# EAGLE design M706D (EAGLE 6.6.0)
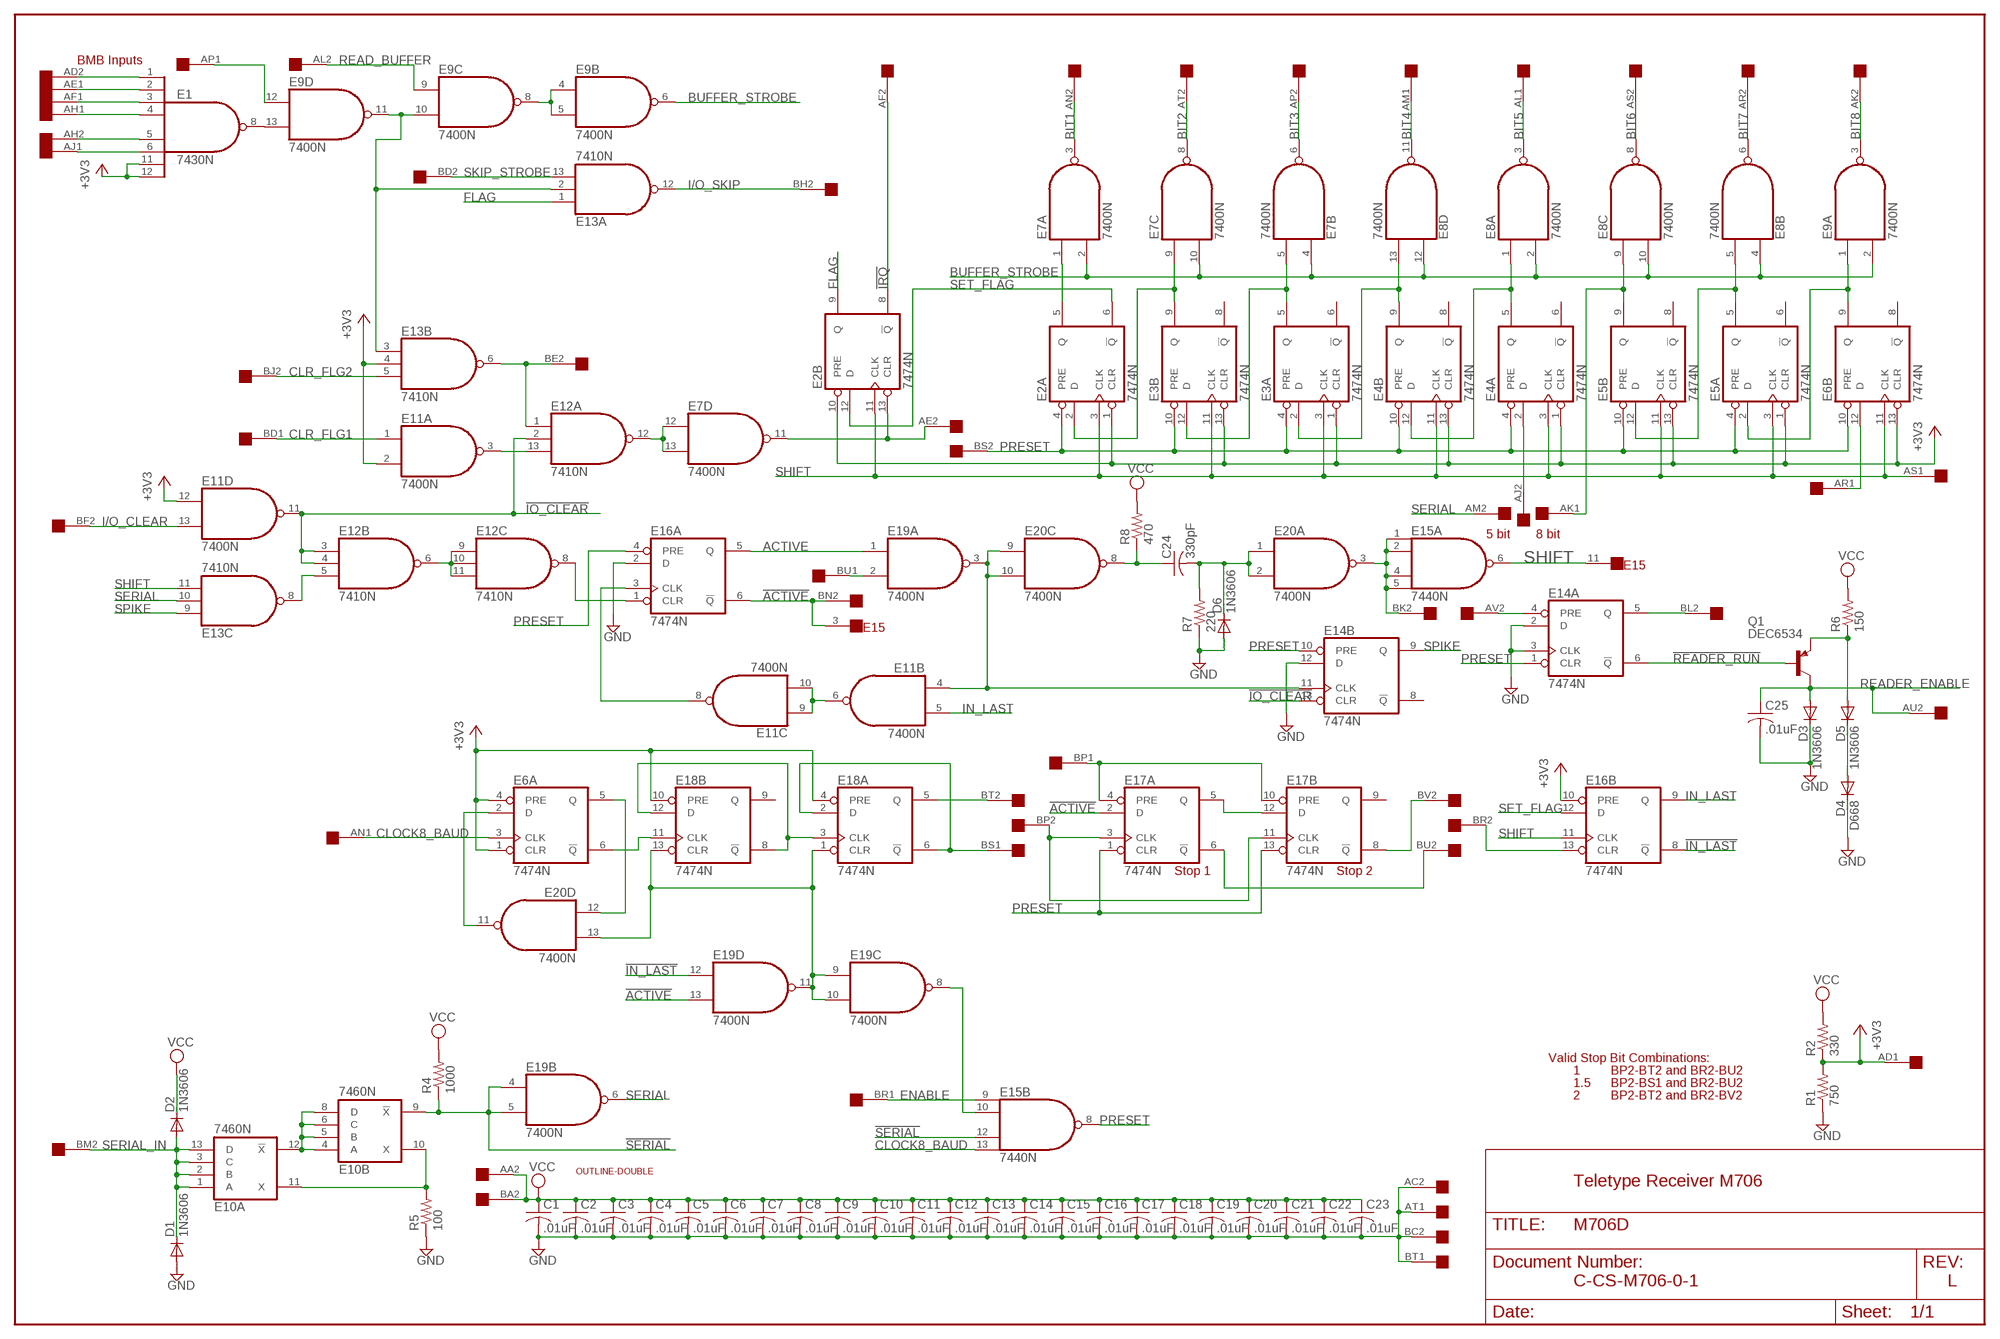
[diagram p0: schematic, sheet 1]

## Parts
C1  .01uF  C-US075-032X103  [C075-032X103]
C2  .01uF  C-US075-032X103  [C075-032X103]
C3  .01uF  C-US075-032X103  [C075-032X103]
C4  .01uF  C-US075-032X103  [C075-032X103]
C5  .01uF  C-US075-032X103  [C075-032X103]
C6  .01uF  C-US075-032X103  [C075-032X103]
C7  .01uF  C-US075-032X103  [C075-032X103]
C8  .01uF  C-US075-032X103  [C075-032X103]
C9  .01uF  C-US075-032X103  [C075-032X103]
C10  .01uF  C-US075-032X103  [C075-032X103]
C11  .01uF  C-US075-032X103  [C075-032X103]
C12  .01uF  C-US075-032X103  [C075-032X103]
C13  .01uF  C-US075-032X103  [C075-032X103]
C14  .01uF  C-US075-032X103  [C075-032X103]
C15  .01uF  C-US075-032X103  [C075-032X103]
C16  .01uF  C-US075-032X103  [C075-032X103]
C17  .01uF  C-US075-032X103  [C075-032X103]
C18  .01uF  C-US075-032X103  [C075-032X103]
C19  .01uF  C-US075-032X103  [C075-032X103]
C20  .01uF  C-US075-032X103  [C075-032X103]
C21  .01uF  C-US075-032X103  [C075-032X103]
C22  .01uF  C-US075-032X103  [C075-032X103]
C23  .01uF  C-US075-032X103  [C075-032X103]
C24  330pF  C-US075-032X103  [C075-032X103]
C25  .01uF  C-US075-032X103  [C075-032X103]
D1  1N3606  DIODE-SOD61B  [SOD61B]
D2  1N3606  DIODE-SOD61B  [SOD61B]
D3  1N3606  1N4148DO35-10  [DO35-10]
D4  D668  1N4148DO35-10  [DO35-10]
D5  1N3606  1N4148DO35-10  [DO35-10]
D6  1N3606  DIODE-SOD61B  [SOD61B]
E1  7430N  [DIL14]
E2  7474N  74S74N  [DIL14]
E3  7474N  74S74N  [DIL14]
E4  7474N  74S74N  [DIL14]
E5  7474N  74S74N  [DIL14]
E6  7474N  74S74N  [DIL14]
E7  7400N  [DIL14]
E8  7400N  [DIL14]
E9  7400N  [DIL14]
E10  7460N  [DIL14]
E11  7400N  [DIL14]
E12  7410N  [DIL14]
E13  7410N  [DIL14]
E14  7474N  74S74N  [DIL14]
E15  7440N  74S40N  [DIL14]
E16  7474N  74S74N  [DIL14]
E17  7474N  74S74N  [DIL14]
E18  7474N  74S74N  [DIL14]
E19  7400N  [DIL14]
E20  7400N  [DIL14]
Q1  DEC6534  BC327-16-PNP-TO92-EBC  [TO92-EBC]
R1  750  R-US_0207/10  [0207/10]
R2  330  R-US_0207/10  [0207/10]
R4  1000  R-US_0207/15  [0207/15]
R5  100  R-US_0207/15  [0207/15]
R6  150  R-US_0207/10  [0207/10]
R7  220  R-US_0207/15  [0207/15]
R8  470  R-US_0207/15  [0207/15]
U$1  OUTLINE-DOUBLE  [DOUBLE]
U$2  DOUBLE  [EDGE-CON4]

## Nets
2^0: E6.5(A:Q) E20.12(D:I0)
!ACTIVE: E15.3(3:NC) E16.6(A:!Q) E17.2(A:D) E19.13(D:I1) U$2.BN2
!IN_LAST: E16.8(B:!Q) E19.12(D:I0)
!IO_CLEAR: E11.11(D:O) E12.2(A:I1) E12.3(B:I0) E12.4(B:I1) E14.13(B:CLR)
!IRQ: E2.8(B:!Q) U$2.AF2
!READER_RUN: E14.6(A:!Q) Q1.B
!SERIAL: E10.9(B:!X) E15.12(B:I2) E19.4(B:I0) E19.5(B:I1) R4.1
+3V3: E1.11(I6) E1.12(I7) E2.1(A:CLR) E2.10(B:PRE) E3.1(A:CLR) E3.13(B:CLR) E4.1(A:CLR) E4.13(B:CLR) E5.1(A:CLR) E5.13(B:CLR) E6.1(A:CLR) E6.4(A:PRE) E6.13(B:CLR) E11.2(A:I1) E11.12(D:I0) E13.4(B:I1) E16.10(B:PRE) E18.4(A:PRE) E18.10(B:PRE) R1.2 R2.1 U$2.AD1
ACTIVE: E16.5(A:Q) E19.1(A:I0)
BIT1: E7.3(A:O) U$2.AN2
BIT2: E7.8(C:O) U$2.AT2
BIT3: E7.6(B:O) U$2.AP2
BIT4: E8.11(D:O) U$2.AM1
BIT5: E8.3(A:O) U$2.AL1
BIT6: E8.8(C:O) U$2.AS2
BIT7: E8.6(B:O) U$2.AR2
BIT8: E9.3(A:O) U$2.AK2
BUFFER_STROBE: E7.2(A:I1) E7.4(B:I0) E7.10(C:I1) E8.2(A:I1) E8.4(B:I0) E8.10(C:I1) E8.12(D:I0) E9.2(A:I1) E9.6(B:O)
CLOCK8_BAUD: E6.3(A:CLK) E15.13(B:I3) U$2.AN1
CLR_FLG1: E11.1(A:I0) U$2.BD1
CLR_FLG2: E13.5(B:I2) U$2.BJ2
ENABLE: E15.9(B:I0) U$2.BR1
FLAG: E2.9(B:Q) E13.1(A:I0)
GND [Supply]: C1.2 C2.2 C3.2 C4.2 C5.2 C6.2 C7.2 C8.2 C9.2 C10.2 C11.2 C12.2 C13.2 C14.2 C15.2 C16.2 C17.2 C18.2 C19.2 C20.2 C21.2 C22.2 C23.2 C25.2 D1.A D3.C D4.C D6.A E14.2(A:D) E14.3(A:CLK) E14.12(B:D) E16.2(A:D) R1.1 R5.1 R7.1 U$2.AC2 U$2.AT1 U$2.BC2 U$2.BT1
I/O_CLEAR: E11.13(D:I1) U$2.BF2
I/O_SKIP: E13.12(A:O) U$2.BH2
IN_LAST: E11.5(B:I1) E16.9(B:Q)
N$1: E15.10(B:I1) E19.8(C:O)
N$2: E5.5(A:Q) E5.12(B:D) E8.5(B:I1)
N$3: E5.2(A:D) E6.9(B:Q) E9.1(A:I0)
N$4: E5.9(B:Q) E8.9(C:I0) U$2.AK1
N$5: E3.5(A:Q) E3.12(B:D) E7.5(B:I1)
N$6: E3.2(A:D) E4.9(B:Q) E8.13(D:I1)
N$7: E4.5(A:Q) E4.12(B:D) E8.1(A:I0)
N$8: E2.5(A:Q) E7.1(A:I0)
N$9: E2.2(A:D) E3.9(B:Q) E7.9(C:I0)
N$10: E1.8(O) E9.13(D:I1)
N$11: E2.13(B:CLR) E7.11(D:O) U$2.AE2
N$12: E7.12(D:I0) E7.13(D:I1) E12.12(A:O)
N$13: E11.8(C:O) E16.3(A:CLK)
N$14: E6.12(B:D) U$2.AR1
N$15: E1.6(I5) U$2.AJ1
N$16: E9.12(D:I0) U$2.AP1
N$17: E1.1(I0) U$2.AD2
N$18: E1.2(I1) U$2.AE1
N$19: E1.3(I2) U$2.AF1
N$20: E1.4(I3) U$2.AH1
N$21: E1.5(I4) U$2.AH2
N$22: E9.4(B:I0) E9.5(B:I1) E9.8(C:O)
N$23: E9.10(C:I1) E9.11(D:O) E13.2(A:I1) E13.3(B:I0)
N$24: E11.3(A:O) E12.13(A:I2)
N$25: E12.1(A:I0) E13.6(B:O) U$2.BE2
N$26: E15.1(A:I0) E15.2(A:I1) E15.4(A:I2) E15.5(A:I3) E20.3(A:O) U$2.BK2
N$27: E6.2(A:D) E20.11(D:O)
N$28: E12.5(B:I2) E13.8(C:O)
N$29: E12.6(B:O) E12.9(C:I0) E12.10(C:I1) E12.11(C:I2)
N$31: E4.2(A:D) U$2.AJ2
N$32: E12.8(C:O) E16.1(A:CLR)
N$33: E6.6(A:!Q) E18.11(B:CLK)
N$34: E18.3(A:CLK) E18.8(B:!Q) E18.12(B:D)
N$35: E18.5(A:Q) U$2.BT2
N$36: E18.2(A:D) E18.6(A:!Q) U$2.BS1
N$37: E17.3(A:CLK) E17.11(B:CLK) U$2.BP2
N$38: E10.4(B:A) E10.5(B:B) E10.6(B:C) E10.8(B:D) E10.12(A:!X)
N$39: E10.10(B:X) E10.11(A:X) R5.2
N$42: E11.6(B:O) E11.9(C:I0) E11.10(C:I1)
N$43: E11.4(B:I0) E14.11(B:CLK) E19.3(A:O) E20.9(C:I0) E20.10(C:I1)
N$45: E18.1(A:CLR) E18.13(B:CLR) E19.9(C:I0) E19.10(C:I1) E19.11(D:O) E20.13(D:I1)
N$48: C24.1 E20.8(C:O) R8.1
N$50: E14.4(A:PRE) U$2.AV2
N$52: E14.5(A:Q) U$2.BL2
N$53: C24.2 D6.C E20.1(A:I0) E20.2(A:I1) R7.2
N$54: D5.A Q1.E R6.1
N$55: D4.A D5.C
N$57: E16.13(B:CLR) U$2.BR2
N$59: E17.6(A:!Q) U$2.BU2
N$60: E17.8(B:!Q) U$2.BV2
N$61: E17.5(A:Q) E17.12(B:D)
N$62: E17.4(A:PRE) E17.10(B:PRE) U$2.BP1
N$63: E19.2(A:I1) U$2.BU1
PRESET: E2.4(A:PRE) E3.4(A:PRE) E3.10(B:PRE) E4.4(A:PRE) E4.10(B:PRE) E5.4(A:PRE) E5.10(B:PRE) E6.10(B:PRE) E14.1(A:CLR) E14.10(B:PRE) E15.8(B:O) E16.4(A:PRE) E17.1(A:CLR) E17.13(B:CLR) U$2.BS2
READ_BUFFER: E9.9(C:I0) U$2.AL2
READER_ENABLE: C25.1 D3.A Q1.C U$2.AU2
SERIAL: E13.10(C:I1) E19.6(B:O) U$2.AM2
SERIAL_IN: D1.C D2.A E10.1(A:A) E10.2(A:B) E10.3(A:C) E10.13(A:D) U$2.BM2
SET_FLAG: E2.6(A:!Q) E2.12(B:D) E16.12(B:D)
SHIFT: E2.3(A:CLK) E2.11(B:CLK) E3.3(A:CLK) E3.11(B:CLK) E4.3(A:CLK) E4.11(B:CLK) E5.3(A:CLK) E5.11(B:CLK) E6.11(B:CLK) E13.11(C:I2) E15.6(A:O) E15.11(11:NC) E16.11(B:CLK) U$2.AS1
SKIP_STROBE: E13.13(A:I2) U$2.BD2
SPIKE: E13.9(C:I0) E14.9(B:Q)
VCC [Supply]: C1.1 C2.1 C3.1 C4.1 C5.1 C6.1 C7.1 C8.1 C9.1 C10.1 C11.1 C12.1 C13.1 C14.1 C15.1 C16.1 C17.1 C18.1 C19.1 C20.1 C21.1 C22.1 C23.1 D2.C R2.2 R4.2 R6.2 R8.2 U$2.AA2 U$2.BA2
Unconnected: E3.6(A:!Q) E3.8(B:!Q) E4.6(A:!Q) E4.8(B:!Q) E5.6(A:!Q) E5.8(B:!Q) E6.8(B:!Q) E14.8(B:!Q) E17.9(B:Q) E18.9(B:Q) E20.4(B:I0) E20.5(B:I1) E20.6(B:O) U$2.AA1 U$2.AB1 U$2.AB2 U$2.AC1 U$2.AU1 U$2.AV1 U$2.BA1 U$2.BB1 U$2.BB2 U$2.BC1 U$2.BE1 U$2.BF1 U$2.BH1 U$2.BJ1 U$2.BK1 U$2.BL1 U$2.BM1 U$2.BN1 U$2.BV1

## Notes on the sheet
- BMB Inputs
- 5 bit | 8 bit
- Stop 1 | Stop 2
- Valid Stop Bit Combinations:
- 1 | BP2-BT2 and BR2-BU2
- 1.5 | BP2-BS1 and BR2-BU2
- 2 | BP2-BT2 and BR2-BV2
- Teletype Receiver M706
- C-CS-M706-0-1 | L

## Power pins joined to a net without a drawn wire
GND: E1.7(GND) E2.7(P:GND) E3.7(P:GND) E4.7(P:GND) E5.7(P:GND) E6.7(P:GND) E7.7(P:GND) E8.7(P:GND) E9.7(P:GND) E10.7(P:GND) E11.7(P:GND) E12.7(P:GND) E13.7(P:GND) E14.7(P:GND) E15.7(P:GND) E16.7(P:GND) E17.7(P:GND) E18.7(P:GND) E19.7(P:GND) E20.7(P:GND)
VCC: E1.14(VCC) E2.14(P:VCC) E3.14(P:VCC) E4.14(P:VCC) E5.14(P:VCC) E6.14(P:VCC) E7.14(P:VCC) E8.14(P:VCC) E9.14(P:VCC) E10.14(P:VCC) E11.14(P:VCC) E12.14(P:VCC) E13.14(P:VCC) E14.14(P:VCC) E15.14(P:VCC) E16.14(P:VCC) E17.14(P:VCC) E18.14(P:VCC) E19.14(P:VCC) E20.14(P:VCC)

## Library data of the parts
C1-C25 = rcl:C-US: CAPACITOR, American symbol
D1 D2 D6 = diode:DIODE-: DIODE
D3-D5 = diode:1N4148: DIODE high speed (Philips)
E1 = 74xx-us:74*30: 8-input NAND gate
E2-E6 E14 E16-E18 = 74xx-us:74*74: Dual D type positive edge triggered FLIP FLOP, preset and clear
E7-E9 E11 E19 E20 = 74xx-us:74*00: Quad 2-input NAND gate
E10 = 74xx-us:74*60: Dual 4-input EXPANDER
E12 E13 = 74xx-us:74*10: Triple 3-input NAND gate
E15 = dec-con:74*40: Dual 4-input NAND gate
Q1 = transistor:*-PNP-: PNP Transistror
R1 R2 R4-R8 = rcl:R-US_: RESISTOR, American symbol
U$1 = dec-con:OUTLINE-*: Board outlines for DEC boards.
U$2 = dec-con:DOUBLE: Double-Height DEC board

## Net classes
1 Supply: width 0.813 mm

## Board
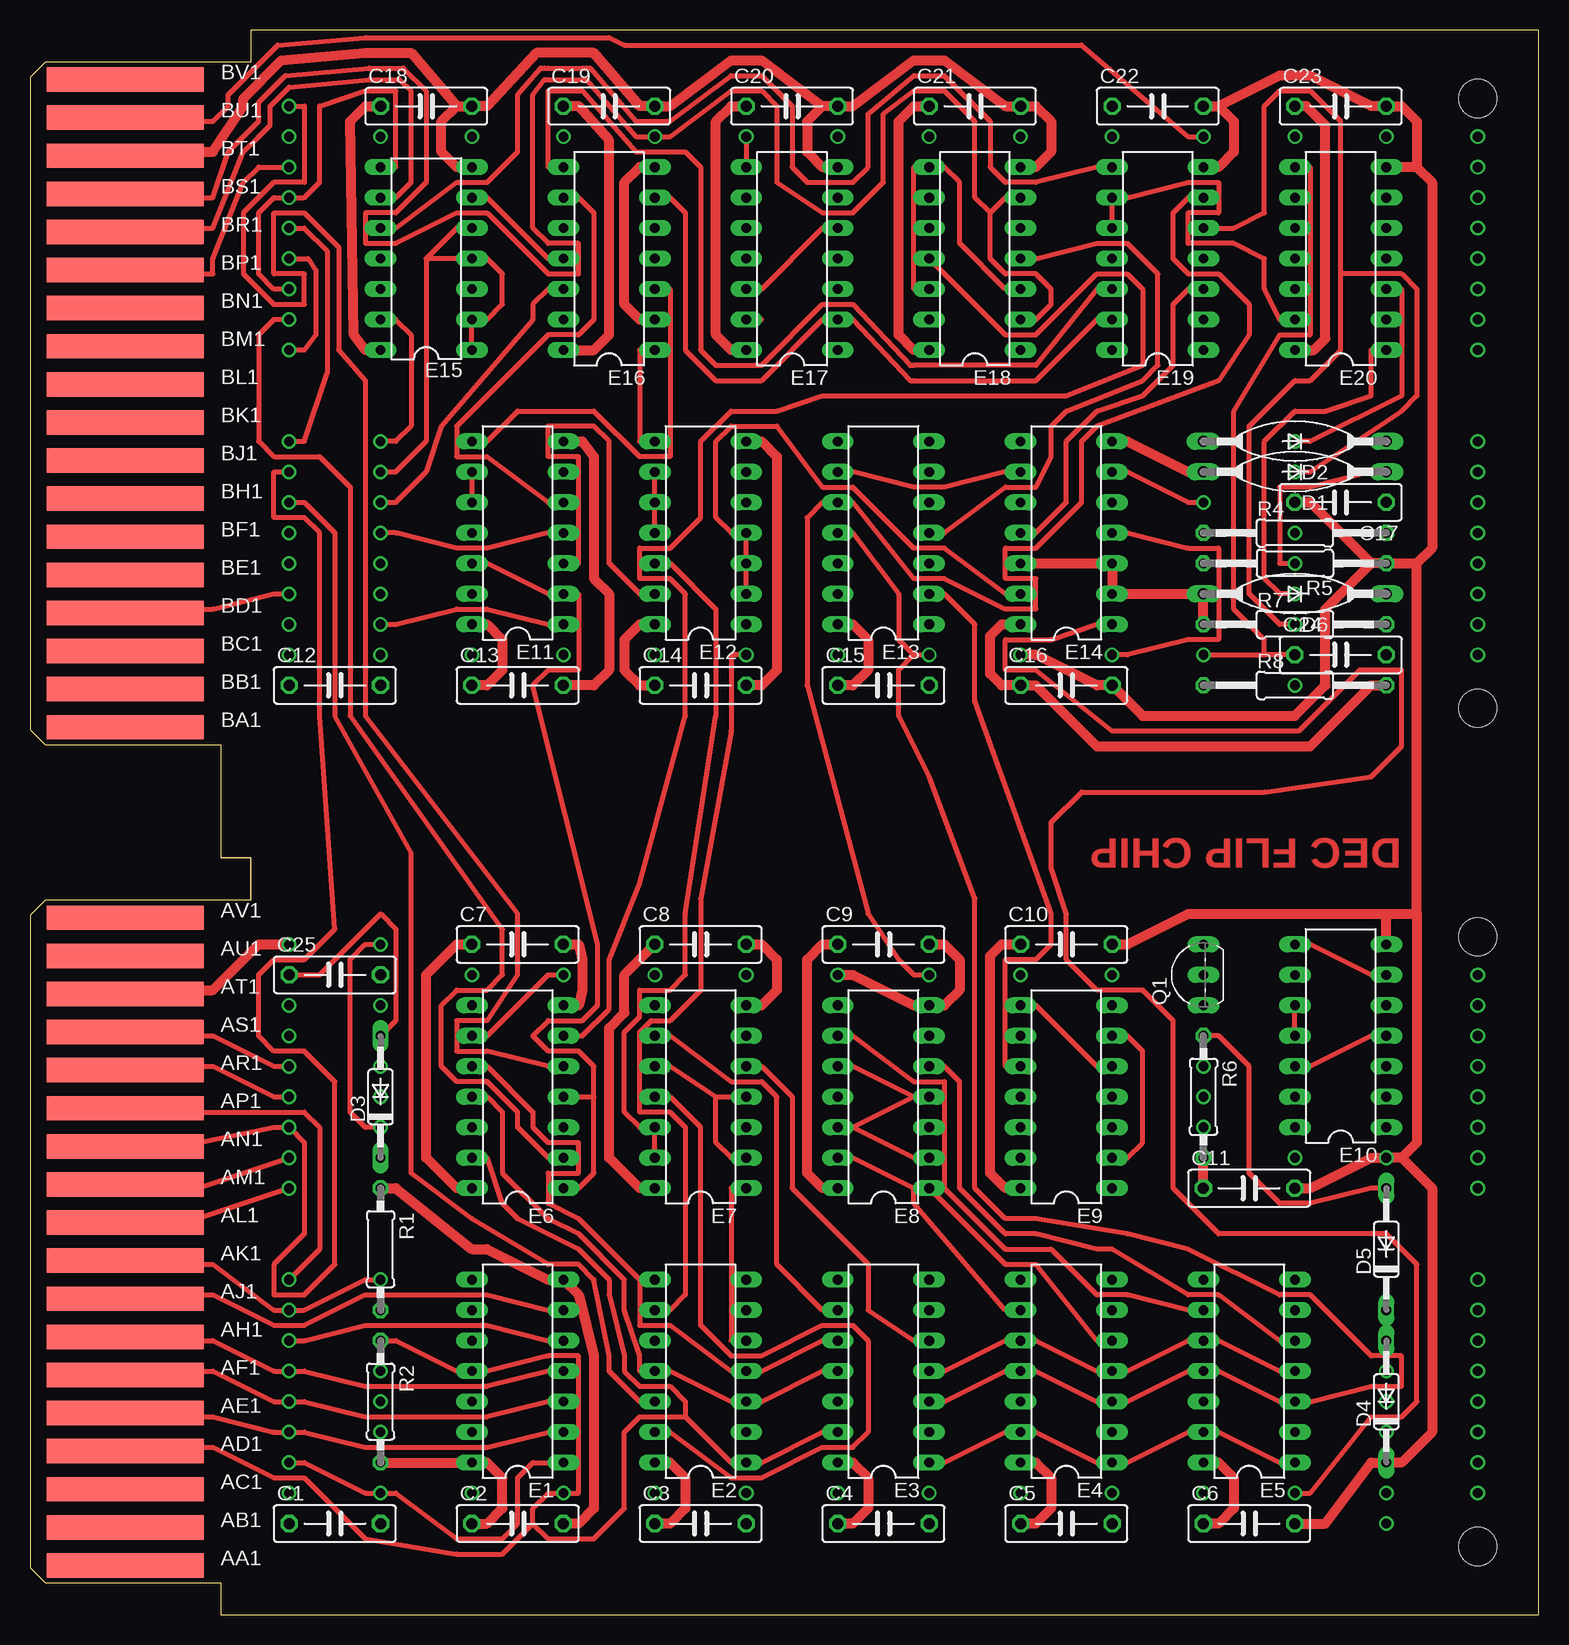
[diagram p1: board, top side]
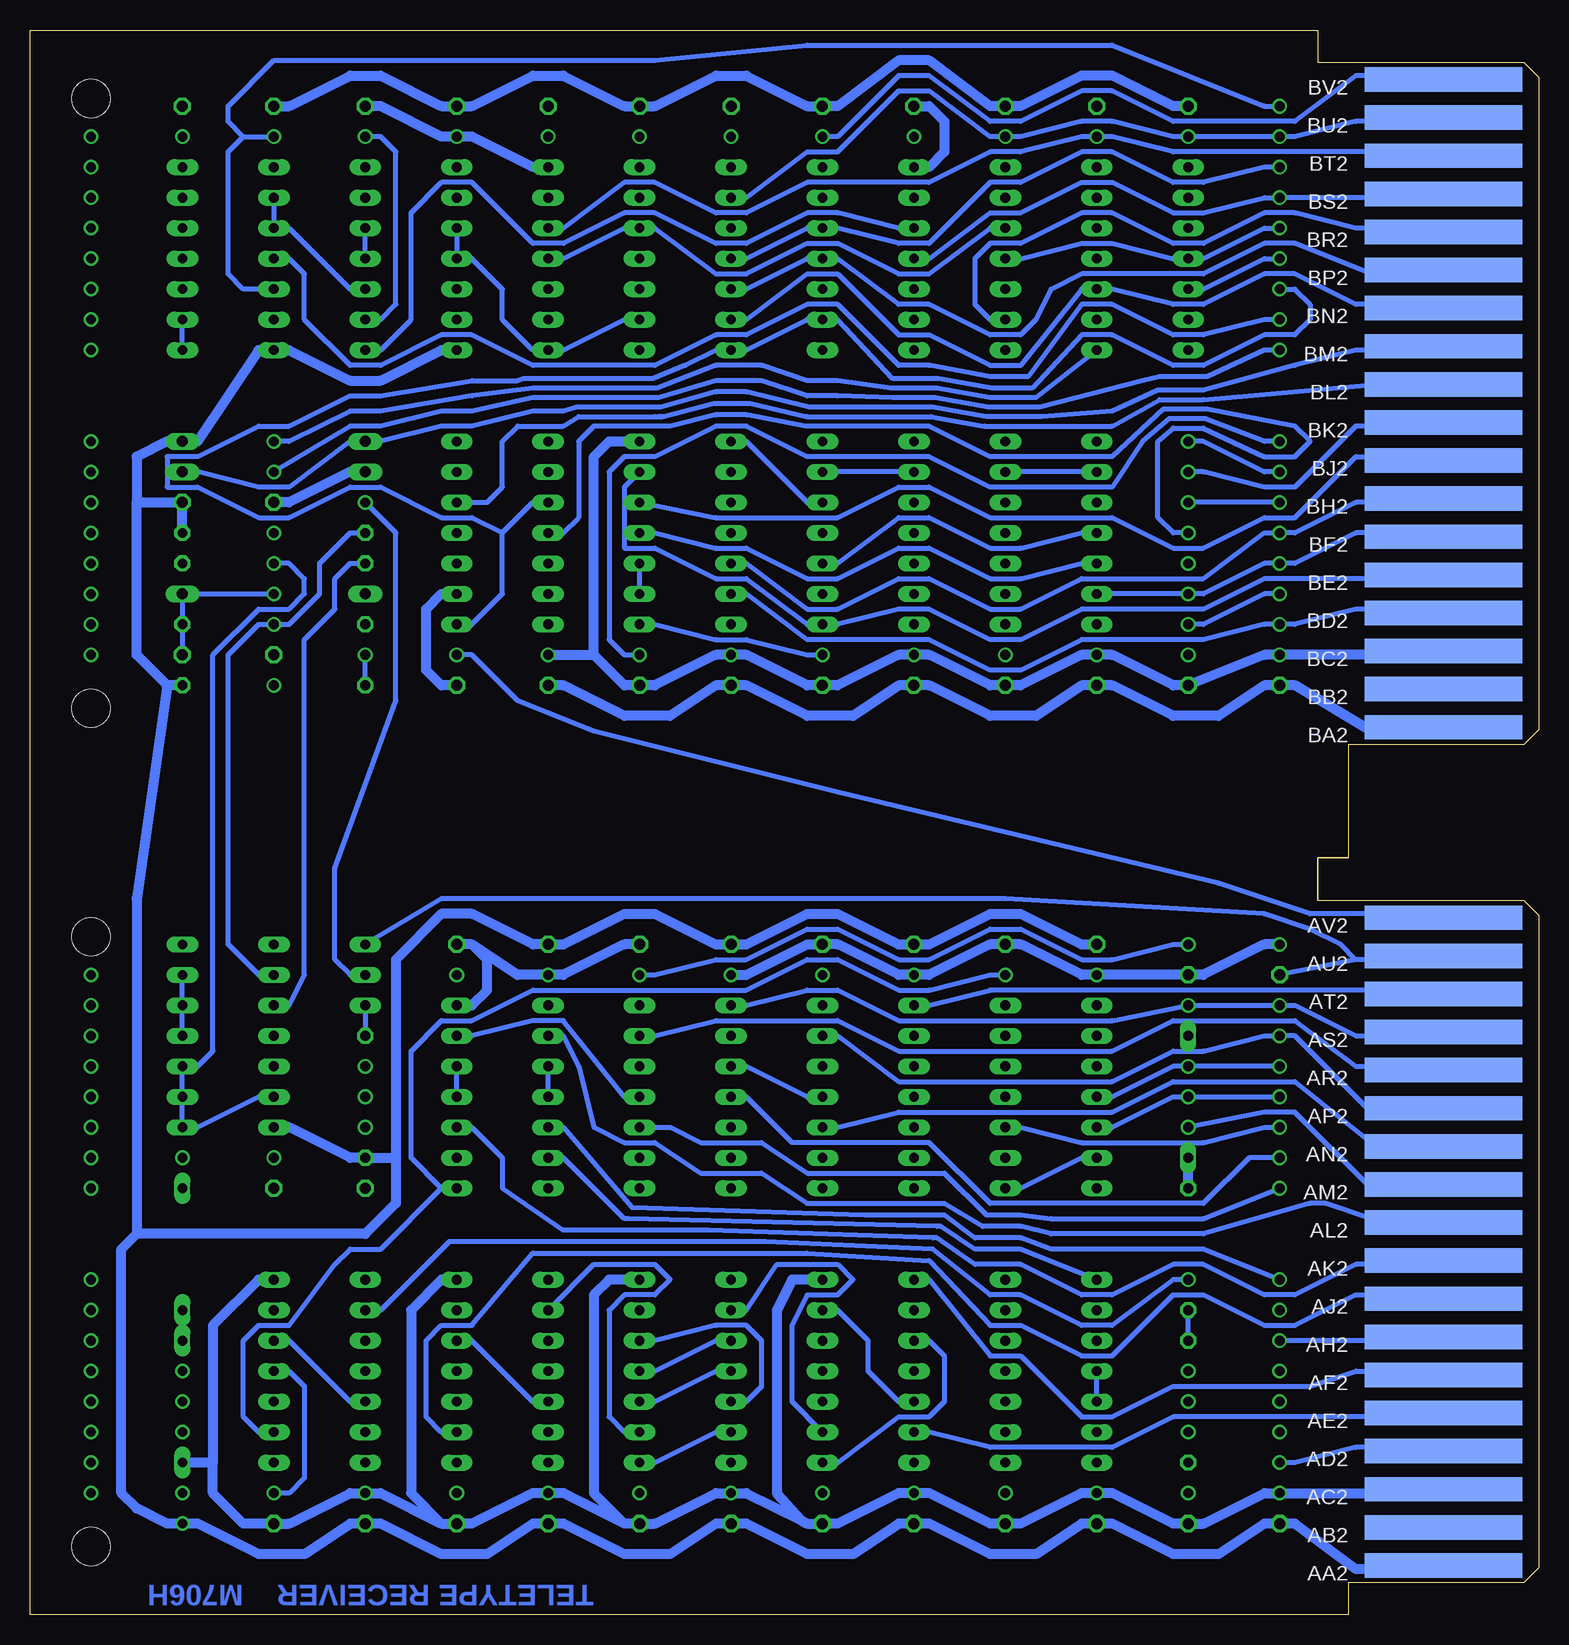
[diagram p2: board, bottom side, seen from below]

Size 125.73 x 132.08 mm. Coordinates in mm from the lower left corner, seen from the top.
Copper layers (1+16): Top 0.035mm / dielectric 1.5mm / Bottom 0.035mm
Design rules "16mils": minimum track width 16mil, minimum drill 32mil, track to track 15mil, track to pad 10mil, pad to pad 10mil, via to via 10mil, smd to smd 10mil, copper to edge 13mil, drill to drill 10mil, minimum pad ring 10mil, minimum via ring 8mil, stop-mask expansion 0mil, vias tented up to drill 0mil, thermal gap 10mil

### Footprints (pad centres in the part's own frame; a part is rotated, then mirrored left to right if it is on the bottom)
C075-032X103 = drill 0.914 octagon: 1 -3.81,0; 2 3.81,0
SOD61B = drill 0.914 long: A 7.62,0; C -7.62,0
DO35-10 = drill 0.813 long: A 5.08,0; C -5.08,0
DIL14 = drill 0.813 long: 1 -7.62,-3.81; 2 -5.08,-3.81; 3 -2.54,-3.81; 4 0,-3.81; 5 2.54,-3.81; 6 5.08,-3.81; 7 7.62,-3.81; 8 7.62,3.81; 9 5.08,3.81; 10 2.54,3.81; 11 0,3.81; 12 -2.54,3.81; 13 -5.08,3.81; 14 -7.62,3.81
TO92-EBC = drill 0.813 long: B 0,-1.27; C 2.54,-1.27; E -2.54,-1.27
0207/10 = drill 0.813 octagon: 1 -5.08,0; 2 5.08,0
0207/15 = drill 0.813 octagon: 1 -7.62,0; 2 7.62,0
DOUBLE = hole 3.175: 120.65,56.515; 120.65,5.715; 120.65,75.565; 120.65,126.365
EDGE-CON4 = smd 13.106 x 2.032: AA1 7.938,4.128; AB1 7.938,7.303; AC1 7.938,10.477; AD1 7.938,13.652; AE1 7.938,16.828; AF1 7.938,20.003; AH1 7.938,23.177; AJ1 7.938,26.352; AK1 7.938,29.527; AL1 7.938,32.703; AM1 7.938,35.877; AN1 7.938,39.053; AP1 7.938,42.227; AR1 7.938,45.403; AS1 7.938,48.578; AT1 7.938,51.752; AU1 7.938,54.928; AV1 7.938,58.102; BA1 7.938,73.978; BB1 7.938,77.153; BC1 7.938,80.328; BD1 7.938,83.502; BE1 7.938,86.677; BF1 7.938,89.853; BH1 7.938,93.028; BJ1 7.938,96.203; BK1 7.938,99.377; BL1 7.938,102.552; BM1 7.938,105.728; BN1 7.938,108.903; BP1 7.938,112.078; BR1 7.938,115.252; BS1 7.938,118.427; BT1 7.938,121.603; BU1 7.938,124.778; BV1 7.938,127.953 | smd 13.106 x 2.032 bottom: AA2 7.938,4.128; AB2 7.938,7.303; AC2 7.938,10.477; AD2 7.938,13.652; AE2 7.938,16.828; AF2 7.938,20.003; AH2 7.938,23.177; AJ2 7.938,26.352; AK2 7.938,29.527; AL2 7.938,32.703; AM2 7.938,35.877; AN2 7.938,39.053; AP2 7.938,42.227; AR2 7.938,45.403; AS2 7.938,48.578; AT2 7.938,51.752; AU2 7.938,54.928; AV2 7.938,58.102; BA2 7.938,73.978; BB2 7.938,77.153; BC2 7.938,80.328; BD2 7.938,83.502; BE2 7.938,86.677; BF2 7.938,89.853; BH2 7.938,93.028; BJ2 7.938,96.203; BK2 7.938,99.377; BL2 7.938,102.552; BM2 7.938,105.728; BN2 7.938,108.903; BP2 7.938,112.078; BR2 7.938,115.252; BS2 7.938,118.427; BT2 7.938,121.603; BU2 7.938,124.778; BV2 7.938,127.953

### Placement (x,y rotation side)
C1  25.4,7.62 0 top
C2  40.64,7.62 0 top
C3  55.88,7.62 0 top
C4  71.12,7.62 0 top
C5  86.36,7.62 0 top
C6  101.6,7.62 0 top
C7  40.64,55.88 0 top
C8  55.88,55.88 0 top
C9  71.12,55.88 0 top
C10  86.36,55.88 0 top
C11  101.6,35.56 0 top
C12  25.4,77.47 0 top
C13  40.64,77.47 0 top
C14  55.88,77.47 0 top
C15  71.12,77.47 0 top
C16  86.36,77.47 0 top
C17  109.22,92.71 180 top
C18  33.02,125.73 0 top
C19  48.26,125.73 0 top
C20  63.5,125.73 0 top
C21  78.74,125.73 0 top
C22  93.98,125.73 0 top
C23  109.22,125.73 0 top
C24  109.22,80.01 0 top
C25  25.4,53.34 0 top
D1  105.41,95.25 180 top
D2  105.41,97.79 180 top
D3  29.21,43.18 90 top
D4  113.03,17.78 90 top
D5  113.03,30.48 90 top
D6  105.41,85.09 180 top
E1  40.64,20.32 90 top
E2  55.88,20.32 90 top
E3  71.12,20.32 90 top
E4  86.36,20.32 90 top
E5  101.6,20.32 90 top
E6  40.64,43.18 90 top
E7  55.88,43.18 90 top
E8  71.12,43.18 90 top
E9  86.36,43.18 90 top
E10  109.22,48.26 90 top
E11  40.64,90.17 90 top
E12  55.88,90.17 90 top
E13  71.12,90.17 90 top
E14  86.36,90.17 90 top
E15  33.02,113.03 90 top
E16  48.26,113.03 90 top
E17  63.5,113.03 90 top
E18  78.74,113.03 90 top
E19  93.98,113.03 90 top
E20  109.22,113.03 90 top
Q1  96.52,53.34 90 top
R1  29.21,30.48 270 top
R2  29.21,17.78 270 top
R4  105.41,90.17 0 top
R5  105.41,87.63 180 top
R6  97.79,43.18 270 top
R7  105.41,82.55 0 top
R8  105.41,77.47 0 top
U$1  0,0 0 top
U$2  0,0 0 top

### Tracks (layer width: path | path; a pad name or v marks a point on that pad's centre or on a via)
2^0  (via drill 0.81)
  Top 0.406: v21.59,125.73 22.86,125.73 22.86,119.38 20.32,119.38 17.78,116.84 17.78,111.76 20.32,109.22 22.86,109.22 22.86,111.76 20.32,111.76 20.32,116.84 22.86,116.84 25.72,113.98 25.72,105.41 27.94,102.87 27.94,74.93 40.64,58.42 40.64,53.34 38.1,49.53 35.56,49.53 35.56,46.99 38.1,46.99 43.18,45.72 E6.5
  Bottom 0.406: E20.12 107.95,110.49 109.22,111.76 109.22,121.92 107.95,123.19 | 107.95,123.19 v105.41,123.19 | 107.95,123.19 109.22,124.46 109.22,125.73 105.41,129.54 73.66,129.54 60.96,130.81 35.56,130.81 22.86,125.73 v21.59,125.73
!ACTIVE
  Top 0.406: E16.6 53.34,118.11 54.61,116.84 54.61,105.41 57.15,102.87 60.96,102.87 66.04,107.95 E17.2 68.58,107.95 73.34,102.87 73.66,102.87 83.82,102.87 88.9,107.95 E19.13
  Bottom 0.406: U$2.BN2 8.89,109.22 15.24,109.22 20.32,111.76 22.86,111.76 27.94,109.22 30.48,109.22 35.56,110.49 E15.3 38.1,110.49 43.18,104.14 45.72,104.14 50.8,106.68 53.34,106.68 58.42,111.76 60.96,111.76 66.04,107.95 E17.2
!IN_LAST
  Top 0.406: E16.8 43.18,120.65 43.18,127 46.04,127 50.48,121.92 54.61,121.92 55.88,120.65 55.88,105.41 57.15,104.14 60.96,104.14 66.04,109.22 68.58,109.22 73.34,104.14 73.66,104.14 83.82,104.14 88.9,110.49 E19.12
!IO_CLEAR
  Top 0.406: E12.2 E12.3 E12.4 58.42,90.17 57.15,91.44 57.15,97.79 58.42,99.06 62.23,99.06 66.04,93.98 68.58,93.98 73.66,88.9 76.2,88.9 81.28,85.09 E14.13
  Bottom 0.406: E12.3 58.42,87.63 53.34,91.44 50.8,91.44 45.72,88.9 43.18,88.9 38.1,90.17 E11.11
!IRQ
  Bottom 0.406: E2.8 50.8,27.94 45.72,21.59 43.18,21.59 38.1,16.51 35.56,16.51 30.48,19.05 19.05,19.05 15.24,20.32 8.89,20.32 U$2.AF2
!READER_RUN  (via drill 0.81)
  Top 0.406: E14.6 91.44,95.25 96.52,92.71 v97.79,92.71
  Bottom 0.406: Q1.B 99.06,53.34 100.33,54.61 100.33,62.23 95.25,76.2 95.25,90.17 v97.79,92.71
!SERIAL  (via drill 0.81)
  Top 0.406: v105.41,82.55 104.14,82.55 101.6,85.09 101.6,99.06 105.41,102.87 106.68,102.87 109.22,105.41 109.22,111.76 | E19.5 100.33,115.57 102.87,116.84 102.87,125.73 104.14,127 106.68,127 109.22,124.46 109.22,111.76 | v21.59,113.03 23.18,113.03 23.81,112.08 23.81,106.68 22.86,105.41 v21.59,105.41 | v105.41,95.25 106.68,95.25 114.3,100.33 115.57,101.6 115.57,110.49 114.3,111.76 109.22,111.76
  Bottom 0.406: E10.9 106.68,53.34 109.22,55.88 109.22,80.01 106.68,82.55 v105.41,82.55 104.14,82.55 101.6,85.09 101.6,87.63 99.06,90.17 R4.1 | E19.4 E19.5 | E15.12 27.94,110.49 22.86,113.03 v21.59,113.03 | v21.59,105.41 22.86,105.41 27.62,103.19 31.59,103.19 33.02,102.87 41.59,100.65 45.88,100.65 50.32,101.44 53.82,101.44 58.42,101.6 60.96,101.6 64.77,102.87 68.58,102.87 73.34,101.44 83.82,101.44 88.9,100.33 91.44,100.33 96.52,99.06 99.06,99.06 v105.41,95.25
+3V3  (via drill 0.81)
  Top 0.406: R2.1 30.48,22.86 35.56,20.32 E1.11 38.1,20.32 43.18,21.59 45.72,21.59 45.72,10.16 v44.45,10.16 43.18,10.16 41.91,8.89 41.91,7.62 | E3.13 66.04,15.24 60.96,12.7 E2.1 58.42,12.7 54.61,16.51 | E3.1 76.2,12.7 81.28,15.24 E4.13 83.82,15.24 88.9,12.7 E4.1 91.44,12.7 96.52,15.24 E5.13 99.06,15.24 104.14,12.7 E5.1 | U$2.AD1 8.89,13.97 15.24,13.97 20.32,11.43 22.86,11.43 27.94,6.35 35.56,5.08 39.37,5.08 41.91,7.62 | 41.91,7.62 43.18,6.35 46.99,6.35 49.53,8.89 49.53,15.24 50.8,16.51 54.61,16.51 | E6.1 45.72,35.56 46.99,36.83 46.99,43.18 | E6.4 46.99,43.18 | 46.99,43.18 46.99,45.72 45.72,46.99 43.18,46.99 41.91,48.26 43.18,49.53 46.04,49.53 47.31,50.8 47.31,55.88 41.91,77.47 43.18,78.74 45.72,78.74 45.72,85.09 E11.2 43.18,85.09 38.1,87.63 E11.12 | 54.61,16.51 54.61,17.78 53.34,19.05 50.8,19.05 49.53,20.32 49.53,21.59 48.26,26.67 48.26,27.94 45.72,30.48 40.64,33.02 39.37,34.29 38.1,38.1 E6.13 | E13.4 76.2,90.17 81.28,93.98 83.82,93.98 85.09,96.52 85.09,99.06 86.36,100.33 92.71,102.87 93.98,104.14 93.98,111.76 91.44,114.3 88.9,114.3 83.82,113.03 E18.4
  Bottom 0.406: R2.1 R1.2 | E3.13 68.58,15.24 73.66,12.7 E3.1 | E2.10 50.8,22.86 49.53,21.59 49.53,17.78 50.8,16.51 53.34,16.51 58.42,12.7 E2.1 | E1.12 E1.11 | E6.13 38.1,38.1 43.18,35.56 E6.1 | E16.10 45.72,115.57 50.8,111.76 53.34,111.76 58.42,114.3 60.96,114.3 66.04,111.76 68.58,111.76 73.66,115.57 E18.10 76.2,115.57 81.28,113.03 E18.4 | E13.4 73.66,90.17 68.58,88.9 66.04,88.9 60.96,86.36 58.42,86.36 53.34,88.9 50.8,88.9 45.72,86.36 43.18,86.36 38.1,87.63 E11.12
ACTIVE
  Bottom 0.406: E16.5 53.34,115.57 58.42,116.84 60.96,116.84 66.04,114.3 68.58,114.3 73.66,116.84 76.2,116.84 81.28,114.3 83.82,114.3 88.9,119.38 91.44,119.38 93.98,116.84 93.98,107.95 96.52,105.41 E19.1
BIT1
  Bottom 0.406: U$2.AN2 8.89,39.37 13.97,39.37 20.32,44.45 30.48,44.45 35.56,41.91 53.34,41.91 58.42,40.64 E7.3
BIT2
  Bottom 0.406: E7.8 50.8,50.8 45.72,52.07 8.89,52.07 U$2.AT2
BIT3  (via drill 0.81)
  Bottom 0.406: U$2.AP2 10.16,41.91 13.97,41.91 20.32,48.26 v21.59,48.26 22.86,48.26 27.94,46.99 30.48,46.99 35.56,44.45 53.34,44.45 58.42,48.26 E7.6
BIT4  (via drill 0.81)
  Top 0.406: U$2.AM1 8.89,35.56 13.97,35.56 v21.59,38.1
  Bottom 0.406: v21.59,38.1 24.13,38.1 27.94,34.29 45.72,34.29 50.8,39.37 62.23,39.37 66.04,43.18 E8.11
BIT5  (via drill 0.81)
  Top 0.406: v21.59,35.56 13.97,33.02 8.89,33.02 U$2.AL1
  Bottom 0.406: E8.3 72.39,40.64 69.85,39.37 64.77,39.37 60.96,36.83 49.53,36.83 46.04,33.34 43.18,33.34 40.64,33.02 27.94,33.02 v21.59,35.56
BIT6  (via drill 0.81)
  Bottom 0.406: E8.8 66.04,50.8 60.96,52.07 58.42,52.07 53.34,49.53 35.56,49.53 v29.21,50.8 v21.59,50.8 20.32,50.8 15.24,48.26 8.89,48.26 U$2.AS2
BIT7
  Bottom 0.406: E8.6 73.66,48.26 68.58,49.53 58.42,49.53 53.34,46.99 35.56,46.99 30.48,49.53 20.32,49.53 15.24,45.72 8.89,45.72 U$2.AR2
BIT8
  Bottom 0.406: U$2.AK2 8.89,29.21 15.24,29.21 20.32,26.67 22.86,26.67 27.94,29.21 30.48,29.21 35.56,26.67 38.1,26.67 43.18,29.21 46.99,29.21 50.17,31.43 50.48,31.43 69.22,32.07 81.28,32.07 86.36,35.56 86.36,38.1 88.9,40.64 E9.3
BUFFER_STROBE
  Top 0.406: E7.10 53.34,45.72 57.15,43.18 | 57.15,43.18 E7.4 | E7.2 58.42,38.1 57.15,39.37 57.15,43.18 | E8.10 68.58,45.72 73.66,43.18 | 73.66,43.18 E8.4 | E8.12 68.58,40.64 | 68.58,40.64 73.66,43.18 | E8.2 73.66,38.1 68.58,40.64 | E9.2 91.44,38.1 92.71,39.37 92.71,46.99 91.44,48.26 E9.6
  Bottom 0.406: E8.10 66.04,45.72 60.96,43.18 E7.4 | E8.4 76.2,43.18 81.28,49.53 83.82,49.53 88.9,48.26 E9.6
CLOCK8_BAUD  (via drill 0.81)
  Top 0.406: U$2.AN1 10.16,39.37 13.97,39.37 20.32,40.64 v21.59,40.64 22.86,39.37 22.86,31.75 20.32,29.21 20.32,26.67 22.86,26.67 25.4,29.21 25.4,44.45 22.86,46.99 20.32,46.99 19.05,48.26 19.05,53.34 20.32,54.61 22.86,54.61 25.4,57.15 24.13,74.93 24.13,90.17 22.86,91.44 20.32,91.44 20.32,95.25 v21.59,95.25 | E15.13 30.48,107.95 31.75,106.68 31.75,99.06 30.48,97.79 v29.21,97.79
  Bottom 0.406: E6.3 43.18,40.64 38.1,39.37 27.94,39.37 22.86,40.64 v21.59,40.64 | v21.59,95.25 22.86,95.25 27.94,97.79 v29.21,97.79
CLR_FLG1  (via drill 0.81)
  Top 0.406: U$2.BD1 8.89,83.82 15.24,83.82 20.32,85.09 v21.59,85.09 | v29.21,82.55 30.48,82.55 35.56,83.82 38.1,83.82 43.18,82.55 E11.1
  Bottom 0.406: v21.59,85.09 22.86,85.09 27.94,82.55 v29.21,82.55
CLR_FLG2
  Bottom 0.406: E13.5 68.58,91.44 58.42,91.44 53.34,93.98 50.8,93.98 45.72,91.44 35.56,91.44 30.48,88.9 27.94,88.9 22.86,91.44 20.32,91.44 15.24,96.52 8.89,96.52 U$2.BJ2
ENABLE
  Top 0.406: U$2.BR1 8.89,115.57 15.24,115.57 17.78,121.92 19.05,123.19 20,124.14 20,125.73 21.59,127.32 28.26,127.95 30.8,127.95 31.75,127 31.75,119.38 30.48,118.11 E15.9
FLAG  (via drill 0.81)
  Top 0.406: v59.69,80.01 58.42,80.01 58.42,73.66 55.88,59.69 55.88,52.07 53.34,49.53 51.75,49.53 50.8,48.58 50.8,41.91 53.34,41.91 54.61,40.64 54.61,26.67 53.34,25.4 E2.9
  Bottom 0.406: E13.1 73.66,82.55 68.58,81.28 66.04,81.28 60.96,80.01 v59.69,80.01
GND  (via drill 0.81)
  Top 0.813: R7.1 D6.A E14.2 E14.3 E14.12 | E14.7 91.44,97.79 96.52,95.25 D1.A | U$2.AT1 11.43,52.07 15.24,52.07 19.05,55.88 v21.59,55.88 | C2.2 45.72,7.62 46.99,8.89 46.99,21.59 45.72,26.67 E1.7 43.18,27.94 38.1,30.48 36.83,30.48 30.48,35.56 R1.1 | 115.57,87.63 R5.1 111.76,87.63 | 111.76,87.63 107.95,83.82 107.95,77.47 105.41,74.93 92.71,74.93 C16.2 88.9,77.47 83.82,80.01 v82.55,80.01 | C17.2 106.68,92.71 111.76,87.63 | E10.7 113.03,58.42 | 113.03,58.42 115.57,58.42 | 115.57,58.42 115.57,87.63 | C10.2 91.44,55.88 96.52,58.42 113.03,58.42 | 115.57,58.42 115.57,39.37 114.3,38.1 | 114.3,38.1 v113.03,38.1 111.76,38.1 106.68,35.56 C11.2 | 114.3,38.1 116.84,35.56 116.84,15.24 114.3,12.7 D4.C 111.76,12.7 107.95,7.62 C6.2 | C7.2 45.72,55.88 46.04,54.61 46.04,52.07 45.72,50.8 E6.7 | C8.2 60.96,55.88 62.23,54.61 62.23,52.07 60.96,50.8 E7.7 | C9.2 76.2,55.88 77.47,54.61 77.47,52.07 76.2,50.8 E8.7 73.66,50.8 68.58,53.34 v67.31,53.34 | U$2.BT1 8.89,121.92 15.24,121.92 17.78,125.73 17.78,126.36 20.96,129.54 27.94,130.18 31.75,130.18 35.56,125.73 | 35.56,125.73 C18.2 38.1,125.73 42.23,130.18 46.99,130.18 50.8,125.73 C19.2 53.34,125.73 58.42,129.54 60.96,129.54 66.04,125.73 | E15.7 35.56,120.65 34.29,121.92 34.29,124.46 35.56,125.73 | 66.04,125.73 C20.2 68.58,125.73 73.66,129.54 76.2,129.54 81.28,125.73 C21.2 83.82,125.73 85.09,124.46 85.09,121.92 83.82,120.65 E18.7 | 66.04,125.73 64.77,124.46 64.77,121.92 66.04,120.65 E17.7 | C22.2 99.06,125.73 | 99.06,125.73 100.33,124.46 100.33,121.92 99.06,120.65 E19.7 | 115.57,120.65 115.57,124.46 114.3,125.73 C23.2 111.76,125.73 106.68,128.27 104.14,128.27 99.06,125.73
  Top 0.813: 115.57,120.65 E20.7 | 115.57,120.65 116.84,119.38 116.84,88.9 115.57,87.63 | E11.7 46.04,97.79 46.99,96.52 46.99,86.36 48.26,85.09 48.26,78.74 46.99,77.47 C13.2 | E12.7 60.96,97.79 62.23,96.52 62.23,78.74 60.96,77.47 C14.2 | E16.2 50.8,107.95 49.53,109.22 49.53,119.38 50.8,120.65 E16.7
  Bottom 0.813: R1.1 D3.C | D1.A 99.06,95.25 104.14,92.71 C17.2 | 78.74,80.01 76.2,77.47 C15.2 73.66,77.47 68.58,80.01 v67.31,80.01 66.04,80.01 60.96,77.47 C14.2 58.42,77.47 53.34,80.01 v52.07,80.01 50.8,80.01 45.72,77.47 C13.2 43.18,77.47 38.1,80.01 v36.83,80.01 35.56,80.01 30.48,77.47 C12.2 22.86,80.01 v21.59,80.01 8.89,80.01 U$2.BC2 | 78.74,80.01 78.74,96.52 77.47,97.79 E13.7 | 110.49,12.7 110.49,10.16 107.95,7.62 C6.2 104.14,7.62 99.06,10.16 v97.79,10.16 96.52,10.16 91.44,7.62 | 110.49,12.7 D4.C | E5.7 106.68,27.94 110.49,24.13 110.49,12.7 | 61.47,7.87 66.04,10.16 v67.31,10.16 68.58,10.16 73.66,7.62 C4.2 76.2,7.62 | 61.47,7.87 60.96,7.62 C3.2 58.42,7.62 53.34,10.16 v52.07,10.16 50.8,10.16 45.72,7.62 C2.2 43.18,7.62 38.1,10.16 v36.83,10.16 35.56,10.16 30.48,7.62 C1.2 27.94,7.62 22.86,10.16 v21.59,10.16 8.89,10.16 U$2.AC2 | 76.2,7.62 81.28,10.16 v82.55,10.16 83.82,10.16 88.9,7.62 C5.2 91.44,7.62 | E4.7 91.44,27.94 93.98,25.4 93.98,10.16 91.44,7.62 | v21.59,55.88 22.86,55.88 27.94,53.34 C25.2 v36.83,53.34 38.1,53.34 43.18,55.88 C7.2 45.72,55.88 50.8,53.34 v52.07,53.34 53.34,53.34 58.42,55.88 C8.2 60.96,55.88 66.04,53.34 v67.31,53.34 | C9.2 76.2,55.88 81.28,53.34 v82.55,53.34 85.09,53.34 88.9,55.88 | 88.9,55.88 C10.2 | E9.7 88.9,50.8 87.63,52.07 87.63,54.61 88.9,55.88 | E2.7 62.23,27.94 63.5,25.4 63.5,10.16 61.47,7.87 | E3.7 77.47,27.94 78.74,26.67 78.74,10.16 76.2,7.62 | C19.2 50.8,125.73 49.53,124.46 49.53,121.92 50.8,120.65 E16.7 | C16.2 91.44,77.47 92.71,78.74 92.71,83.82 91.44,85.09 E14.2 | E18.7 83.82,120.65 88.9,123.19 v90.17,123.19 91.44,123.19 96.52,125.73 C22.2
  Bottom 0.813: v82.55,80.01 78.74,80.01
I/O_CLEAR  (via drill 0.81)
  Bottom 0.406: U$2.BF2 8.89,90.17 15.24,90.17 20.32,87.63 v21.59,87.63 22.86,87.63 27.94,85.09 v29.21,85.09 E11.13
I/O_SKIP  (via drill 0.81)
  Bottom 0.406: U$2.BH2 8.89,92.71 15.24,92.71 20.32,90.17 v21.59,90.17 22.86,90.17 27.94,86.36 38.1,86.36 43.18,83.82 45.72,83.82 50.8,86.36 53.34,86.36 58.42,83.82 60.96,83.82 66.04,87.63 E13.12
IN_LAST
  Top 0.406: E16.9 45.72,118.11 46.99,116.84 46.99,107.95 45.72,106.68 43.18,106.68 35.56,99.06 35.56,96.52 38.1,96.52 43.18,92.71 E11.5
N$1
  Top 0.406: E15.10 30.48,115.57 35.56,119.38 38.1,119.38 40.64,121.92 40.64,126.68 42.55,128.91 42.86,128.91 43.18,128.91 46.04,128.91 46.36,128.91 46.67,128.91 50.48,124.46 53.34,124.46 58.42,128.27 60.96,128.27 63.5,125.73 63.5,120.65 64.77,119.38 68.58,119.38 69.85,120.65 69.85,125.09 73.66,128.27 76.2,128.27 80.01,124.46 80.01,120.65 81.28,119.38 83.82,119.38 88.9,120.65 E19.8
N$2
  Top 0.406: E5.5 104.14,22.86 99.06,26.67 96.52,26.67 90.17,30.48 88.9,30.48 83.82,31.75 81.28,31.75 77.47,35.56 77.47,44.45 76.2,45.72 E8.5
  Bottom 0.406: E5.12 99.06,17.78 104.14,22.86 E5.5
N$3  (via drill 0.81)
  Top 0.406: E6.9 38.1,48.26 43.18,53.34 v44.45,53.34
  Bottom 0.406: E9.1 91.44,35.56 | 91.44,35.56 93.98,38.1 93.98,46.99 91.44,49.53 88.9,49.53 83.82,52.07 66.04,52.07 60.96,54.61 58.42,54.61 53.34,52.07 50.8,52.07 45.72,53.34 v44.45,53.34 | E5.2 106.68,15.24 107.95,16.51 107.95,22.86 106.68,24.13 104.14,24.13 100.33,29.21 99.06,30.48 96.52,30.48 91.44,35.56
N$4  (via drill 0.81)
  Top 0.406: U$2.AK1 10.16,29.21 15.24,29.21 20.32,25.4 v21.59,25.4 22.86,25.4 27.94,27.94 v29.21,27.94 | E5.9 96.52,25.4 91.44,26.67 88.9,26.67 85.09,30.48 81.28,30.48 76.2,35.56 76.2,44.45 73.66,44.45 68.58,48.26 E8.9
  Bottom 0.406: v29.21,27.94 30.48,27.94 35.56,24.13 38.1,24.13 43.18,26.67 45.72,26.67 50.48,30.48 64.45,31.11 90.81,31.11 96.52,25.4 E5.9
N$5
  Top 0.406: E7.5 60.96,45.72 63.5,43.18 63.5,35.56 69.85,29.21 69.85,25.4 73.66,22.86 E3.5
  Bottom 0.406: E3.12 66.04,17.78 64.77,19.05 64.77,22.86 66.04,24.13 68.58,24.13 73.66,22.86 E3.5
N$6
  Top 0.406: E4.9 81.28,25.4 73.66,34.29 73.66,35.56 68.58,38.1 E8.13
  Bottom 0.406: E4.9 78.74,29.21 73.66,29.21 72.39,27.94 73.66,26.67 76.2,26.67 77.47,25.4 77.47,16.51 76.2,15.24 E3.2
N$7
  Top 0.406: E8.1 81.28,29.21 83.82,29.21 88.9,22.86 E4.5
  Bottom 0.406: E4.5 88.9,22.86 83.82,17.78 E4.12
N$8
  Top 0.406: E2.5 58.42,22.86 58.42,35.56 E7.1
N$9
  Top 0.406: E3.9 66.04,25.4 62.23,29.21 62.23,43.18 60.96,44.45 58.42,44.45 53.34,48.26 E7.9
  Bottom 0.406: E2.2 62.23,17.78 62.23,24.13 60.96,26.67 58.42,26.67 57.15,27.94 58.42,29.21 63.5,29.21 66.04,25.4 E3.9
N$10
  Bottom 0.406: E1.8 43.18,30.48 46.99,30.48 49.85,32.38 50.17,32.38 75.88,33.02 76.2,33.02 81.28,38.1 E9.13
N$11
  Top 0.406: E2.13 53.34,15.24 58.42,11.43 60.96,11.43 66.04,13.97 68.58,13.97 69.85,15.24 69.85,22.86 68.58,24.13 66.04,24.13 60.96,21.59 58.42,21.59 55.88,24.13 55.88,40.64 53.34,43.18 E7.11
  Bottom 0.406: U$2.AE2 8.89,16.51 30.48,16.51 35.56,13.97 45.72,13.97 50.8,15.24 E2.13
N$12
  Top 0.406: E12.12 53.34,87.63 57.15,83.82 57.15,74.93 54.61,58.42 54.61,53.34 53.34,52.07 50.8,52.07 50.8,49.85 49.53,48.58 49.53,41.91 50.8,40.64 E7.12 E7.13
N$13
  Top 0.406: E16.3 53.34,110.49 53.34,96.52 50.8,96.52 46.99,100.33 40.64,100.33 38.1,97.79 E11.8
N$14  (via drill 0.81)
  Top 0.406: U$2.AR1 8.89,45.72 15.24,45.72 20.32,43.18 v21.59,43.18
  Bottom 0.406: E6.12 35.56,40.64 30.48,43.18 v29.21,43.18 v21.59,43.18
N$15
  Top 0.406: U$2.AJ1 10.16,26.67 15.24,26.67 20.32,24.13 22.86,24.13 27.94,26.67 38.1,26.67 43.18,25.4 E1.6
N$16  (via drill 0.81)
  Top 0.406: U$2.AP1 8.89,41.91 22.86,41.91 24.13,40.64 24.13,30.48 v21.59,27.94
  Bottom 0.406: E9.12 81.28,40.64 75.57,33.97 56.2,33.34 49.53,33.34 46.99,31.43 43.18,31.43 40.64,30.48 27.94,30.48 v21.59,27.94
N$17  (via drill 0.81)
  Top 0.406: v21.59,12.7 22.86,12.7 27.94,10.16 v29.21,10.16 30.48,10.16 35.56,6.35 39.37,6.35 40.64,7.62 40.64,11.43 41.91,12.7 E1.1
  Bottom 0.406: U$2.AD2 8.89,13.97 15.24,13.97 20.32,12.7 v21.59,12.7
N$18  (via drill 0.81)
  Top 0.406: U$2.AE1 8.89,16.51 15.24,16.51 20.32,15.24 v21.59,15.24 22.86,15.24 27.94,13.97 38.1,13.97 43.18,15.24 E1.2
N$19  (via drill 0.81)
  Top 0.406: U$2.AF1 8.89,20.32 15.24,20.32 20.32,17.78 v21.59,17.78 22.86,17.78 27.94,16.51 38.1,16.51 43.18,17.78 E1.3
N$20  (via drill 0.81)
  Top 0.406: U$2.AH1 8.89,22.86 15.24,22.86 20.32,20.32 v21.59,20.32 22.86,20.32 27.94,19.05 38.1,19.05 43.18,20.32 E1.4
N$21  (via drill 0.81)
  Top 0.406: v21.59,22.86 22.86,22.86 27.94,24.13 38.1,24.13 43.18,22.86 E1.5
  Bottom 0.406: U$2.AH2 8.89,22.86 v21.59,22.86
N$22
  Top 0.406: E9.8 83.82,50.8 88.9,45.72 E9.5
  Bottom 0.406: E9.4 E9.5
N$23
  Top 0.406: E13.2 76.2,85.09 78.74,82.55 78.74,76.2 85.09,58.42 85.09,55.88 83.82,54.61 81.28,54.61 81.28,45.72 E9.10
  Bottom 0.406: E9.11 E9.10 | E13.2 E13.3
N$24
  Top 0.406: E12.13 50.8,85.09 48.26,87.63 48.26,97.79 46.99,99.06 43.18,99.06 43.18,96.52 45.72,96.52 45.72,87.63 E11.3
N$25
  Bottom 0.406: E13.6 76.2,93.98 76.2,88.9 73.66,88.9 68.58,86.36 66.04,86.36 60.96,82.55 E12.1 58.42,82.55 53.34,83.82 50.8,83.82 45.72,81.28 43.18,81.28 38.1,83.82 27.94,83.82 22.86,86.36 8.89,86.36 U$2.BE2
N$26  (via drill 0.81)
  Top 0.406: v29.21,95.25 30.48,95.25 33.02,97.79 33.02,113.03 | E15.1 E15.2 38.1,107.95 39.37,109.22 39.37,111.76 38.1,113.03 E15.4 33.02,113.03 | E20.3 114.3,110.49 114.3,101.6 106.68,97.79 v105.41,97.79 | E15.5 35.56,115.57 33.02,113.03
  Bottom 0.406: U$2.BK2 8.89,99.06 15.24,99.06 20.32,93.98 22.86,93.98 27.94,95.25 v29.21,95.25 | E15.1 41.91,101.44 45.72,101.44 50.17,102.23 53.98,102.23 58.42,102.87 60.96,102.87 64.77,104.14 68.58,104.14 73.5,102.23 83.82,102.23 88.9,101.6 96.52,100.33 99.06,100.33 104.14,97.79 v105.41,97.79
N$27  (via drill 0.81)
  Top 0.406: v21.59,107.95 20.32,107.95 19.05,106.68 19.05,97.79 20.32,96.52 24.13,96.52 26.67,93.98 26.67,74.93 39.37,57.15 39.37,53.34 38.1,52.07 35.56,52.07 34.29,50.8 34.29,45.72 35.56,44.45 38.1,44.45 40.64,41.91 40.64,40.64 43.18,38.1 E6.2
  Bottom 0.406: E20.11 104.14,113.03 102.87,111.76 102.87,107.95 99.06,104.14 96.52,104.14 91.44,106.68 88.9,106.68 83.82,104.14 73.66,104.14 68.58,106.68 66.04,106.68 60.96,109.22 58.42,109.22 53.34,104.14 50.8,104.14 45.72,103.19 42.55,103.19 38.1,109.22 35.56,109.22 30.48,106.68 27.94,106.68 22.86,107.95 v21.59,107.95
N$28
  Bottom 0.406: E12.5 60.96,92.71 66.04,97.79 E13.8
N$29
  Top 0.406: E12.11 E12.10 E12.9
  Bottom 0.406: E12.9 E12.6
N$30  (via drill 0.81)
  other vias: 29.21,15.24
N$31
  Bottom 0.406: E4.2 91.44,15.24 92.71,16.51 92.71,22.86 91.44,24.13 88.9,24.13 83.82,30.16 60.96,30.16 50.8,29.53 45.72,24.13 43.18,24.13 38.1,21.59 35.56,21.59 30.48,26.67 27.94,26.67 22.86,24.13 20.32,24.13 15.24,26.67 8.89,26.67 U$2.AJ2
N$32
  Top 0.406: E16.1 50.8,105.41 50.8,97.79 E12.8
N$33
  Top 0.406: E6.6 46.04,48.26 48.26,50.48 48.26,54.61 50.8,60.96 54.61,74.93 54.61,85.09 53.34,86.36 50.8,86.36 50.8,88.9 53.34,88.9 55.88,91.44 55.88,97.79 58.42,100.33 62.23,100.33 66.04,101.6 86.36,101.6 92.71,104.14 92.71,110.49 91.44,111.76 88.9,111.76 83.82,106.68 81.28,106.68 E18.11
N$34
  Top 0.406: E18.12 73.66,110.49 73.66,120.65 E18.8 76.2,120.65 77.47,119.38 77.47,114.3 81.28,110.49 E18.3
N$35  (via drill 0.81)
  Bottom 0.406: U$2.BT2 8.89,121.92 30.48,121.92 35.56,123.19 v36.83,123.19 38.1,123.19 43.18,121.92 45.72,121.92 50.8,119.38 60.96,119.38 66.04,116.84 68.58,116.84 73.66,119.38 76.2,119.38 81.28,115.57 E18.5
N$36  (via drill 0.81)
  Top 0.406: U$2.BS1 8.89,118.11 15.24,118.11 16.51,121.92 19.05,124.46 19.05,126.05 21.27,128.27 28.26,128.91 31.12,128.91 33.02,127 33.02,119.38 30.48,116.84 27.94,116.84 27.94,114.3 30.48,114.3 35.56,116.84 38.1,116.84 43.18,111.76 45.72,111.76 45.72,114.3 43.18,114.3 41.91,115.57 41.91,126.68 42.86,127.95 43.18,127.95 46.04,127.95 46.36,127.95 50.48,123.19 v52.07,123.19 53.34,123.19 58.42,127 60.96,127 62.23,125.73 62.23,119.38 66.04,116.84 68.58,116.84 71.12,119.38 71.12,125.09 73.66,127 76.2,127 78.74,124.46 78.74,118.11 80.01,116.84 | E18.2 83.82,107.95 85.09,109.22 85.09,110.49 83.82,111.76 81.28,111.76 80.01,113.03 80.01,116.84 | 80.01,116.84 81.28,118.11 E18.6
N$37
  Bottom 0.406: U$2.BP2 8.89,111.76 13.97,111.76 20.32,114.3 22.86,114.3 27.94,111.76 38.1,111.76 40.64,110.49 41.91,107.95 43.18,106.68 45.72,106.68 50.8,109.22 53.34,109.22 58.42,113.03 E17.11 60.96,113.03 66.04,110.49 E17.3
N$38
  Top 0.406: E10.4 111.76,48.26 106.68,45.72 E10.12 | E10.8 106.68,55.88 111.76,53.34 E10.6
  Bottom 0.406: E10.4 E10.5 E10.6
N$39
  Top 0.406: E10.11 E10.10
  Bottom 0.406: E10.10 104.14,50.8 102.87,53.34 102.87,81.28 100.33,83.82 100.33,86.36 99.06,87.63 R5.2
N$40  (via drill 0.81)
  other vias: 29.21,17.78
N$41  (via drill 0.81)
  other vias: 29.21,20.32
N$42
  Top 0.406: E11.9 E11.10
  Bottom 0.406: E11.9 E11.6
N$43  (via drill 0.81)
  Top 0.406: E11.4 43.18,90.17 38.1,88.9 35.56,88.9 30.48,90.17 v29.21,90.17 | E14.11 83.82,90.17 86.36,92.71 86.36,97.79 88.9,100.33 92.71,101.6 95.25,104.14 95.25,109.22 96.52,110.49 E19.3
  Bottom 0.406: E14.11 81.28,90.17 80.01,91.44 80.01,97.79 78.74,99.06 72.39,99.06 68.58,100.01 66.04,100.01 61.12,99.06 50.8,99.06 45.72,96.52 35.56,96.52 31.27,100.49 27.62,100.49 20.32,99.06 19.05,97.79 20.32,96.52 22.86,96.52 27.94,98.9 30.48,98.9 31.75,97.79 31.75,91.44 30.48,90.17 v29.21,90.17 | E20.9 E20.10 104.14,115.57 99.06,110.49 E19.3
N$44  (via drill 0.81)
  other vias: 105.41,77.47
N$45
  Top 0.406: E19.10 E19.9 91.44,118.11 96.52,119.38 99.06,119.38 99.06,116.84 96.52,116.84 96.52,114.3 100.33,114.3 102.87,113.03 102.87,110.49 104.14,107.95 E20.13
  Bottom 0.406: E19.10 E19.11 88.9,113.03 86.36,110.49 86.36,107.95 83.82,105.41 E18.1 81.28,105.41 76.2,107.95 E18.13
N$46  (via drill 0.81)
  other vias: 105.41,90.17
N$47  (via drill 0.81)
  other vias: 44.45,80.01
N$48  (via drill 0.81)
  Top 0.406: v97.79,80.01 102.87,80.01 | C24.1 102.87,80.01 | 102.87,80.01 102.87,81.28 100.33,83.82 100.33,100.33 104.14,106.68 106.68,106.68 106.68,120.65 E20.8
  Bottom 0.406: R8.1 v97.79,80.01
N$49  (via drill 0.81)
  other vias: 105.41,38.1
N$50  (via drill 0.81)
  Top 0.406: E14.4 91.44,90.17 96.52,88.9 99.06,88.9 99.06,81.28 96.52,81.28 91.44,80.01 v90.17,80.01
  Bottom 0.406: U$2.AV2 8.89,58.1 8.89,58.42 19.05,58.42 26.67,60.96 58.42,68.58 78.74,73.66 85.09,76.2 88.9,80.01 v90.17,80.01
N$51  (via drill 0.81)
  other vias: 29.21,80.01
N$52
  Bottom 0.406: U$2.BL2 10.16,102.87 27.94,101.28 31.59,101.28 35.56,99.06 46.2,99.06 50.64,99.85 60.96,99.85 65.72,100.97 68.74,100.97 73.03,99.85 73.18,99.85 73.34,99.85 73.66,99.85 80.01,99.85 81.28,99.06 85.09,99.06 86.36,97.79 86.36,93.98 87.63,92.71 E14.5
N$53  (via drill 0.81)
  Top 0.406: v105.41,85.09 104.14,85.09 102.87,86.36 102.87,97.79 105.41,100.33 107.95,100.33 111.76,101.6 111.76,105.41 E20.1
  Bottom 0.406: v105.41,85.09 D6.C R7.2 C24.2 | E20.1 E20.2
N$54
  Top 0.406: D5.A 111.76,35.56 106.68,34.29 104.14,34.29 101.6,36.83 101.6,45.72 99.06,48.26 R6.1
  Bottom 0.406: Q1.E R6.1
N$55
  Bottom 0.406: D4.A D5.C
N$56  (via drill 0.81)
  other vias: 29.21,87.63
N$57
  Bottom 0.406: U$2.BR2 10.16,115.57 15.24,115.57 20.32,116.84 22.86,116.84 27.94,114.3 30.48,114.3 35.56,116.84 38.1,116.84 43.18,114.3 45.72,114.3 46.99,113.03 46.99,109.22 45.72,107.95 E16.13
N$58  (via drill 0.81)
  other vias: 97.79,40.64
N$59  (via drill 0.81)
  Bottom 0.406: U$2.BU2 10.16,124.46 15.24,124.46 20.32,123.19 v21.59,123.19 v29.21,123.19 30.48,123.19 35.56,124.46 38.1,124.46 43.18,123.19 v44.45,123.19 45.72,123.19 50.8,127 53.34,127 58.42,121.92 60.96,121.92 66.04,118.11 E17.6
N$60  (via drill 0.81)
  Top 0.406: v59.69,123.19 E17.8
  Bottom 0.406: U$2.BV2 8.89,128.27 15.24,128.27 20.32,124.46 30.48,124.46 35.56,127 38.1,127 43.18,124.46 45.72,124.46 50.8,128.27 53.34,128.27 58.42,123.19 v59.69,123.19
N$61
  Top 0.406: E17.12 60.96,110.49 66.04,115.57 E17.5
N$62  (via drill 0.81)
  Top 0.406: U$2.BP1 8.89,111.76 15.24,111.76 15.24,113.03 17.78,119.38 19.05,120.65 v21.59,120.65
  Bottom 0.406: v21.59,120.65 22.86,120.65 27.94,119.38 30.48,119.38 35.56,121.92 38.1,121.92 43.18,119.38 45.72,119.38 50.8,114.3 53.34,114.3 58.42,115.57 E17.10 60.96,115.57 66.04,113.03 E17.4
N$63  (via drill 0.81)
  Top 0.406: U$2.BU1 8.89,124.46 15.24,124.46 16.51,125.73 16.51,126.68 20.64,130.81 27.94,131.44 48.26,131.44 49.53,130.81 87.63,130.81 96.52,123.19 v97.79,123.19
  Bottom 0.406: E19.2 96.52,107.95 95.25,109.22 95.25,121.92 96.52,123.19 v97.79,123.19
N$64  (via drill 0.81)
  other vias: 97.79,43.18
N$65  (via drill 0.81)
  other vias: 97.79,45.72
N$67  (via drill 0.81)
  other vias: 113.03,10.16
N$68  (via drill 0.81)
  other vias: 113.03,15.24
N$69  (via drill 0.81)
  other vias: 113.03,17.78
N$70  (via drill 0.81)
  other vias: 113.03,20.32
N$71  (via drill 0.81)
  other vias: 120.65,10.16
N$72  (via drill 0.81)
  other vias: 120.65,12.7
N$73  (via drill 0.81)
  other vias: 120.65,15.24
N$74  (via drill 0.81)
  other vias: 120.65,17.78
N$75  (via drill 0.81)
  other vias: 120.65,20.32
N$76  (via drill 0.81)
  other vias: 120.65,22.86
N$77  (via drill 0.81)
  other vias: 120.65,25.4
N$78  (via drill 0.81)
  other vias: 120.65,27.94
N$79  (via drill 0.81)
  other vias: 120.65,35.56
N$80  (via drill 0.81)
  other vias: 120.65,38.1
N$81  (via drill 0.81)
  other vias: 120.65,40.64
N$82  (via drill 0.81)
  other vias: 120.65,43.18
N$83  (via drill 0.81)
  other vias: 120.65,45.72
N$84  (via drill 0.81)
  other vias: 120.65,48.26
N$85  (via drill 0.81)
  other vias: 120.65,50.8
N$86  (via drill 0.81)
  other vias: 120.65,53.34
N$87  (via drill 0.81)
  other vias: 120.65,80.01
N$88  (via drill 0.81)
  other vias: 120.65,82.55
N$89  (via drill 0.81)
  other vias: 120.65,85.09
N$90  (via drill 0.81)
  other vias: 120.65,87.63
N$91  (via drill 0.81)
  other vias: 120.65,90.17
N$92  (via drill 0.81)
  other vias: 120.65,92.71
N$93  (via drill 0.81)
  other vias: 120.65,95.25
N$94  (via drill 0.81)
  other vias: 120.65,97.79
N$95  (via drill 0.81)
  other vias: 120.65,105.41
N$96  (via drill 0.81)
  other vias: 120.65,107.95
N$97  (via drill 0.81)
  other vias: 120.65,110.49
N$98  (via drill 0.81)
  other vias: 120.65,113.03
N$99  (via drill 0.81)
  other vias: 120.65,115.57
N$100  (via drill 0.81)
  other vias: 120.65,118.11
N$101  (via drill 0.81)
  other vias: 120.65,120.65
N$102  (via drill 0.81)
  other vias: 120.65,123.19
N$103  (via drill 0.81)
  other vias: 113.03,123.19
N$106  (via drill 0.81)
  other vias: 90.17,10.16
N$107  (via drill 0.81)
  other vias: 74.93,10.16
N$108  (via drill 0.81)
  other vias: 59.69,10.16
N$109  (via drill 0.81)
  other vias: 59.69,53.34
N$111  (via drill 0.81)
  other vias: 90.17,53.34
N$117  (via drill 0.81)
  other vias: 67.31,123.19
N$118  (via drill 0.81)
  other vias: 74.93,123.19
N$119  (via drill 0.81)
  other vias: 82.55,123.19
PRESET  (via drill 0.81)
  Top 0.406: E3.4 76.2,20.32 81.28,22.86 E4.10 83.82,22.86 88.9,20.32 E4.4 91.44,20.32 96.52,22.86 E5.10 99.06,22.86 104.14,20.32 E5.4 | E3.10 66.04,22.86 60.96,20.32 E2.4 58.42,20.32 53.34,24.13 50.8,24.13 50.8,27.94 45.72,33.02 43.18,34.29 43.18,36.83 45.72,36.83 45.72,39.37 43.18,39.37 41.91,40.64 41.91,41.91 38.1,45.72 E6.10 | E15.8 30.48,120.65 30.48,127 27.94,127 24.13,125.73 24.13,119.38 22.86,118.11 v21.59,118.11 20.32,118.11 19.05,116.84 19.05,111.76 20.32,110.49 v21.59,110.49 | v105.41,10.16 106.68,10.16 111.76,16.51 114.3,16.51 115.57,17.78 115.57,29.21 113.03,31.75 99.06,31.75 95.25,35.56 95.25,49.53 92.71,52.07 88.9,52.07 86.36,54.61 86.36,58.42 85.09,62.23 85.09,66.04 87.63,68.58 102.87,68.58 111.76,69.85 114.3,72.39 114.3,78.74 110.81,78.74 105.73,73.66 90.17,73.66 83.82,78.74 81.28,78.74 81.28,81.28 85.09,81.28 88.9,82.55 E14.1 | E17.13 60.96,107.95
  Bottom 0.406: E3.10 68.58,22.86 73.66,20.32 E3.4 | E5.4 104.14,20.32 102.87,19.05 102.87,11.43 104.14,10.16 v105.41,10.16 | U$2.BS2 8.89,118.11 v21.59,118.11 22.86,118.11 27.94,116.84 30.48,116.84 35.56,119.38 38.1,119.38 43.18,116.84 45.72,116.84 50.8,113.03 E16.4 | E14.1 88.9,82.55 86.36,85.09 86.36,90.17 | 86.36,90.17 83.82,92.71 E14.10 | v21.59,110.49 20.32,110.49 19.05,109.22 19.05,107.95 20.32,106.68 22.86,106.68 27.94,104.14 30.48,104.14 35.56,106.68 38.1,106.68 42.23,102.23 45.56,102.23 50.01,103.03 53.82,103.03 58.42,107.95 E17.13 60.96,107.95 66.04,105.41 E17.1 68.58,105.41 71.12,104.14 73.82,103.03 84.61,103.03 85.09,102.87 88.9,102.87 96.52,101.6 99.06,101.6 104.14,99.06 106.68,99.06 111.76,96.52 114.3,96.52 114.3,93.98 111.76,93.98 106.68,91.44 104.14,91.44 99.06,93.98 96.52,93.98 91.44,91.44 88.9,91.44 86.36,90.17
READ_BUFFER
  Bottom 0.406: U$2.AL2 8.89,33.02 13.97,33.02 17.78,34.29 19.05,34.29 27.94,31.75 40.64,31.75 43.18,32.38 46.36,32.38 49.53,34.29 60.96,34.29 64.77,36.83 69.85,36.83 73.66,39.37 76.2,39.37 78.74,40.64 80.01,45.72 81.28,48.26 E9.9
READER_ENABLE
  Top 0.406: C25.1 24.13,53.34 29.21,58.42 30.48,57.15 30.48,49.53 D3.A
  Bottom 0.406: U$2.AU2 8.89,54.61 15.24,54.61 | 15.24,54.61 16.51,55.88 19.05,57.15 22.86,58.42 44.45,59.69 91.44,59.69 Q1.C | 15.24,54.61 C25.1
SERIAL  (via drill 0.81)
  Top 0.406: v29.21,40.64 27.94,40.64 26.67,41.91 26.67,54.61 27.94,55.88 v29.21,55.88 | v74.93,53.34 73.66,53.34 72.39,54.61 69.85,58.42 64.77,77.47 64.77,91.44 66.04,92.71 E13.10 68.58,92.71 73.66,86.36 76.2,86.36 81.28,83.82 83.82,83.82 83.82,86.36 81.28,86.36 81.28,88.9 83.82,88.9 87.63,92.71 87.63,97.79 88.9,99.06 99.06,102.87 101.6,106.68 101.6,109.22 99.06,111.76 96.52,111.76 95.25,113.03 95.25,116.84 96.52,118.11 E19.6
  Bottom 0.406: U$2.AM2 8.89,35.56 13.97,35.56 20.32,41.91 22.86,41.91 v29.21,40.64 | v74.93,53.34 73.66,53.34 68.58,54.61 66.04,54.61 60.96,57.15 58.42,57.15 53.34,54.61 50.8,54.61 45.72,57.15 43.18,57.15 38.1,54.61 35.56,54.61 30.48,55.88 v29.21,55.88
SERIAL_IN  (via drill 0.81)
  Top 0.406: D1.C 111.76,95.25 106.68,93.98 104.14,93.98 104.14,87.63 v105.41,87.63
  Bottom 0.406: E10.13 106.68,43.18 111.76,40.64 E10.1 E10.2 E10.3 111.76,45.72 110.49,46.99 110.49,80.01 106.68,83.82 104.14,83.82 102.87,85.09 102.87,86.36 104.14,87.63 v105.41,87.63 | U$2.BM2 8.89,105.41 15.24,105.41 20.32,104.14 27.94,102.08 31.75,102.08 35.56,100.33 41.43,99.85 46.04,99.85 50.48,100.65 60.8,100.65 66.04,101.92 68.58,101.92 73.18,100.65 73.34,100.65 73.66,100.65 80.01,100.65 80.17,100.65 81.28,100.33 83.82,100.33 88.9,99.06 91.44,99.06 96.52,97.79 D2.A 99.06,97.79 104.14,93.98 106.68,93.98 111.76,95.25 D1.C
SET_FLAG  (via drill 0.81)
  Top 0.406: E2.12 50.8,17.78 48.26,20.32 48.26,21.59 46.99,27.94 45.72,29.21 43.18,29.21 36.83,33.02 31.75,36.83 31.75,63.5 25.4,74.93 25.4,90.17 22.86,92.71 v21.59,92.71 | E16.12 43.18,110.49 41.91,109.22 41.91,107.95 34.29,99.06 33.02,95.25 30.48,92.71 v29.21,92.71
  Bottom 0.406: E2.12 53.34,17.78 55.88,20.32 55.88,22.86 58.42,25.4 E2.6 | v21.59,92.71 v29.21,92.71
SHIFT  (via drill 0.81)
  Top 0.406: E3.3 76.2,17.78 81.28,20.32 E4.11 83.82,20.32 88.9,17.78 E4.3 91.44,17.78 96.52,20.32 E5.11 99.06,20.32 104.14,17.78 E5.3 106.68,17.78 111.76,19.05 114.3,19.05 114.3,21.59 111.76,21.59 106.68,26.67 104.14,26.67 96.52,30.48 91.44,31.75 83.82,33.02 81.28,33.02 78.74,35.56 78.74,59.69 74.93,69.85 72.39,74.93 72.39,78.74 73.66,80.01 | E3.11 66.04,20.32 60.96,17.78 E2.3 58.42,17.78 53.34,20.32 E2.11 50.8,20.32 50.8,21.59 49.53,25.4 49.53,27.94 45.72,31.75 43.18,33.02 39.37,36.83 39.37,41.91 38.1,43.18 E6.11 | U$2.AS1 10.16,48.26 15.24,48.26 20.32,45.72 v21.59,45.72 | v21.59,115.57 22.86,115.57 24.77,113.67 24.77,103.5 22.86,97.79 v21.59,97.79 | 73.66,80.01 v74.93,80.01 | E15.6 38.1,118.11 43.18,113.03 E16.11 | E13.11 68.58,90.17 72.39,85.09 72.39,81.28 73.66,80.01
  Bottom 0.406: E3.11 68.58,20.32 73.66,17.78 E3.3 | v21.59,45.72 v29.21,45.72 30.48,45.72 35.56,43.18 E6.11 | E16.11 43.18,113.03 38.1,114.3 35.56,114.3 30.48,113.03 E15.11 27.94,113.03 22.86,115.57 v21.59,115.57 | v21.59,97.79 22.86,97.79 27.78,99.69 30.8,99.69 33.02,97.79 35.56,93.98 45.72,93.98 50.8,96.52 60.96,96.52 66.04,99.06 68.58,99.06 73.66,96.52 76.2,96.52 77.47,95.25 77.47,81.28 76.2,80.01 v74.93,80.01
SKIP_STROBE  (via drill 0.81)
  Bottom 0.406: U$2.BD2 8.89,83.82 15.24,83.82 20.32,82.55 v21.59,82.55 22.86,82.55 27.94,81.28 38.1,81.28 43.18,78.74 45.72,78.74 50.8,81.28 60.96,81.28 66.04,85.09 E13.13
SPIKE
  Top 0.406: E14.9 81.28,95.25 76.2,93.98 73.66,93.98 68.58,95.25 E13.9
VCC  (via drill 0.81)
  Top 0.813: C2.1 38.1,7.62 39.37,8.89 39.37,11.43 38.1,12.7 E1.14 R2.2 | E2.14 53.34,12.7 54.61,11.43 54.61,8.89 53.34,7.62 C3.1 | E3.14 68.58,12.7 69.85,11.43 69.85,8.89 68.58,7.62 C4.1 | E4.14 83.82,12.7 85.09,11.43 85.09,8.89 83.82,7.62 C5.1 | E5.14 99.06,12.7 100.33,11.43 100.33,8.89 99.06,7.62 C6.1 | R8.2 111.76,77.47 106.68,72.39 88.9,72.39 83.82,77.47 C16.1 80.96,77.47 80.01,78.42 80.01,81.6 80.96,82.55 E14.14 | E11.14 38.1,82.55 39.37,81.28 39.37,78.74 38.1,77.47 C13.1 | E12.14 50.8,82.55 49.53,81.28 49.53,78.74 50.8,77.47 C14.1 | E13.14 68.58,82.55 69.85,81.28 69.85,78.74 68.58,77.47 C15.1 | C11.1 R6.2 | E15.14 27.94,105.41 26.99,106.68 26.67,124.46 27.94,125.73 C18.1 | E6.14 35.56,35.56 33.02,38.1 33.02,53.34 35.56,55.88 C7.1 | E7.14 50.8,35.56 48.26,38.1 48.26,48.9 49.53,50.16 49.53,53.34 C8.1 | E8.14 66.04,35.56 64.77,36.83 64.77,54.61 66.04,55.88 C9.1 | E9.14 81.28,35.56 80.01,36.83 80.01,54.93 80.96,55.88 C10.1 | E20.14 107,105.41 107.95,106.36 107.95,124.14 106.36,125.73 C23.1 | E16.14 46.99,105.41 48.26,106.68 48.26,122.87 45.72,125.73 C19.1 | E17.14 58.42,105.41 57.15,106.68 57.15,124.46 58.42,125.73 C20.1 | E18.14 73.66,105.41 72.39,106.68 72.39,124.46 73.66,125.73 C21.1
  Bottom 0.813: C16.1 81.28,77.47 76.2,74.93 72.39,74.93 68.58,77.47 C15.1 66.04,77.47 60.96,74.93 57.15,74.93 53.34,77.47 C14.1 50.8,77.47 45.72,74.93 41.91,74.93 38.1,77.47 C13.1 35.56,77.47 30.48,74.93 26.67,74.93 22.86,77.47 C12.1 20.32,77.47 13.97,73.66 7.62,73.66 U$2.BA2 | U$2.AA2 8.89,3.81 15.24,3.81 20.32,7.62 C1.1 22.86,7.62 26.67,5.08 30.48,5.08 35.56,7.62 C2.1 38.1,7.62 41.91,5.08 45.72,5.08 50.8,7.62 C3.1 53.34,7.62 57.15,5.08 60.96,5.08 66.04,7.62 C4.1 68.58,7.62 72.39,5.08 76.2,5.08 81.28,7.62 C5.1 83.82,7.62 87.63,5.08 91.44,5.08 96.52,7.62 C6.1 99.06,7.62 102.87,5.08 106.68,5.08 111.76,7.62 v113.03,7.62 114.3,7.62 116.84,8.89 118.11,10.16 118.11,30.48 116.84,31.75 | E10.14 104.14,40.64 99.06,38.1 R6.2 95.25,38.1 | C7.1 38.1,55.88 43.18,58.42 45.72,58.42 50.8,55.88 C8.1 53.34,55.88 58.42,58.42 60.96,58.42 66.04,55.88 C9.1 68.58,55.88 73.66,58.42 76.2,58.42 81.28,55.88 C10.1 83.82,55.88 88.9,58.42 91.44,58.42 95.25,54.61 95.25,38.1 | 95.25,38.1 95.25,34.29 97.79,31.75 116.84,31.75 | 114.3,77.47 116.84,80.01 116.84,92.71 | 116.84,92.71 C17.1 R4.2 | 116.84,92.71 116.84,96.52 114.3,97.79 D2.C 111.76,97.79 106.68,105.41 E20.14 104.14,105.41 99.06,102.87 96.52,102.87 91.44,105.41 E19.14 | C23.1 104.14,125.73 99.06,128.27 96.52,128.27 91.44,125.73 C22.1 88.9,125.73 83.82,128.27 81.28,128.27 76.2,125.73 C21.1 73.66,125.73 68.58,128.27 66.04,128.27 60.96,125.73 C20.1 58.42,125.73 53.34,129.54 50.8,129.54 45.72,125.73 C19.1 43.18,125.73 38.1,128.27 35.56,128.27 30.48,125.73 C18.1 | R8.2 114.3,77.47 | 114.3,77.47 116.84,59.69 116.84,31.75

### Text on the board
Top: DEC FLIP CHIP
Bottom: TELETYPE RECEIVER | M706H